# Altium schematic sheet kr1_3.SchDoc
size 420 x 297 mm; SheetNumber: 1; SheetTotal: 1
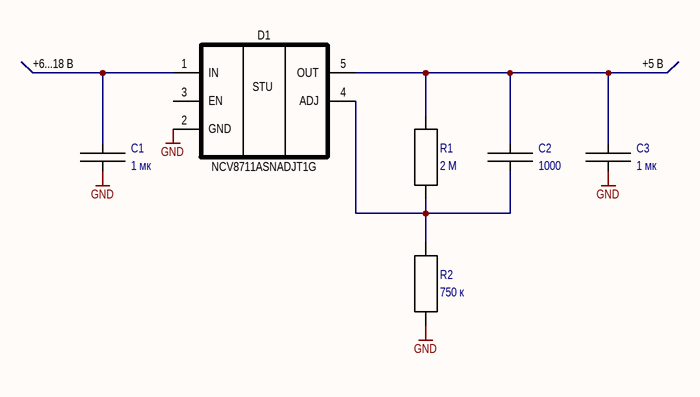
[diagram p0: kr1_3.SchDoc]

## Parts
C1  value 1 мк  (hidden comment: 1 мкФ ±* * * *, *)
C2  value 1000  (hidden comment: 1000Ф ±* * * *, *)
C3  value 1 мк  (hidden comment: 1 мкФ ±* * * *, *)
D1  NCV8711ASNADJT1G
R1  value 2 М
R2  value 750 к

## Nets
GND: C1.1 C3.1 D1.2(GND) R2.2
NetC1_2: C1.2 D1.1(IN)
NetC2_1: C2.1 D1.4(ADJ) R1.2 R2.1
NetC2_2: C2.2 C3.2 D1.5(OUT) R1.1

Not connected (* = marked no-connect by the designer): D1 3(EN)

## Notes on the sheet
- +6...18 В
- +5 В
- Перв.примен.
- Справ. №
- Подп. и дата
- Инв.№ дубл.
- Взам. инв. №
- Изм.
- Лист
- № докум.
- Подп.
- Дата
- Лит.
- Масса
- Масштаб
- Пров.
- Т.контр
- Разраб.
- Схема электрическая принципиальная
- 1
- Листов
- Инв № подл.
- Н.контр.
- Утв.
- Копировал
- Формат А3
- (in symbol NCV8711) STU

## Library data of the parts
C1-C3 = C: Company: *; PartNumber: *; Tolerance: *; Voltage: *; Type: *; Package: *
D1 = NCV8711
R1 R2 = R: Company: *; PartNumber: *; Package: *; Tolerance: *